# Altium schematic sheet led.SchDoc
size A4
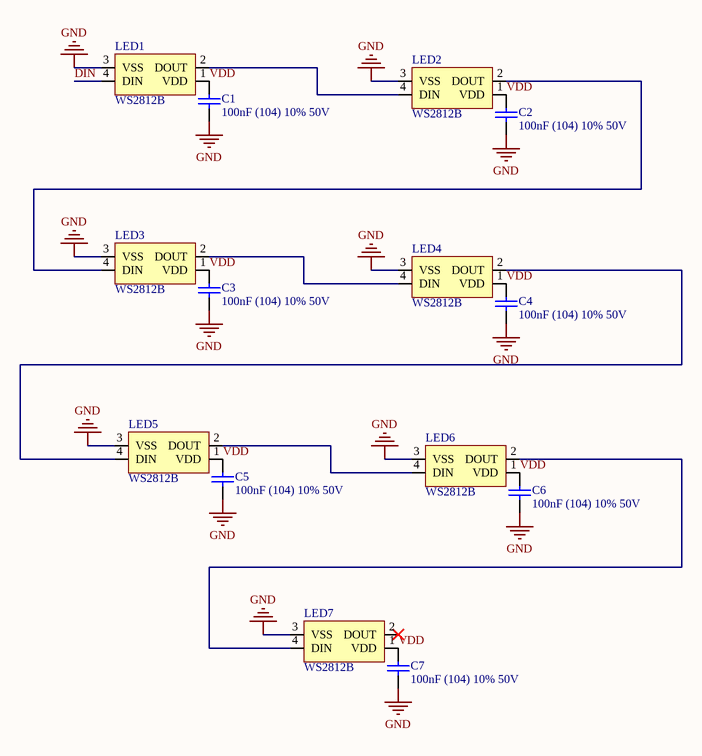
[diagram p0: led.SchDoc]

## Parts
C1  100nF (104) 10% 50V  [0603_C]
C2  100nF (104) 10% 50V  [0603_C]
C3  100nF (104) 10% 50V  [0603_C]
C4  100nF (104) 10% 50V  [0603_C]
C5  100nF (104) 10% 50V  [0603_C]
C6  100nF (104) 10% 50V  [0603_C]
C7  100nF (104) 10% 50V  [0603_C]
LED1  WS2812B  [WS2812]
LED2  WS2812B  [WS2812]
LED3  WS2812B  [WS2812]
LED4  WS2812B  [WS2812]
LED5  WS2812B  [WS2812]
LED6  WS2812B  [WS2812]
LED7  WS2812B  [WS2812]

## Nets
GND: C1.2 C2.2 C3.2 C4.2 C5.2 C6.2 C7.2 LED1.3(VSS) LED2.3(VSS) LED3.3(VSS) LED4.3(VSS) LED5.3(VSS) LED6.3(VSS) LED7.3(VSS)
DIN: LED1.4(DIN)
VDD: C1.1 C2.1 C3.1 C4.1 C5.1 C6.1 C7.1 LED1.1(VDD) LED2.1(VDD) LED3.1(VDD) LED4.1(VDD) LED5.1(VDD) LED6.1(VDD) LED7.1(VDD)
NetLED1_2: LED1.2(DOUT) LED2.4(DIN)
NetLED2_2: LED2.2(DOUT) LED3.4(DIN)
NetLED3_2: LED3.2(DOUT) LED4.4(DIN)
NetLED4_2: LED4.2(DOUT) LED5.4(DIN)
NetLED5_2: LED5.2(DOUT) LED6.4(DIN)
NetLED6_2: LED6.2(DOUT) LED7.4(DIN)

Not connected (* = marked no-connect by the designer): LED7 2(DOUT)*

## Library data of the parts
C1-C7 = 0603 100nF (104) 10% 50V: 贴片电容; ComponentLink1Description: 供应商链接; ComponentLink1URL: http://www.szlcsc.com/product/details_15331.html; Package: 0603; Supplier: LC; SuppliersPartNumber: C14663